# EAGLE design dsbrut2 (EAGLE 6.5.0)
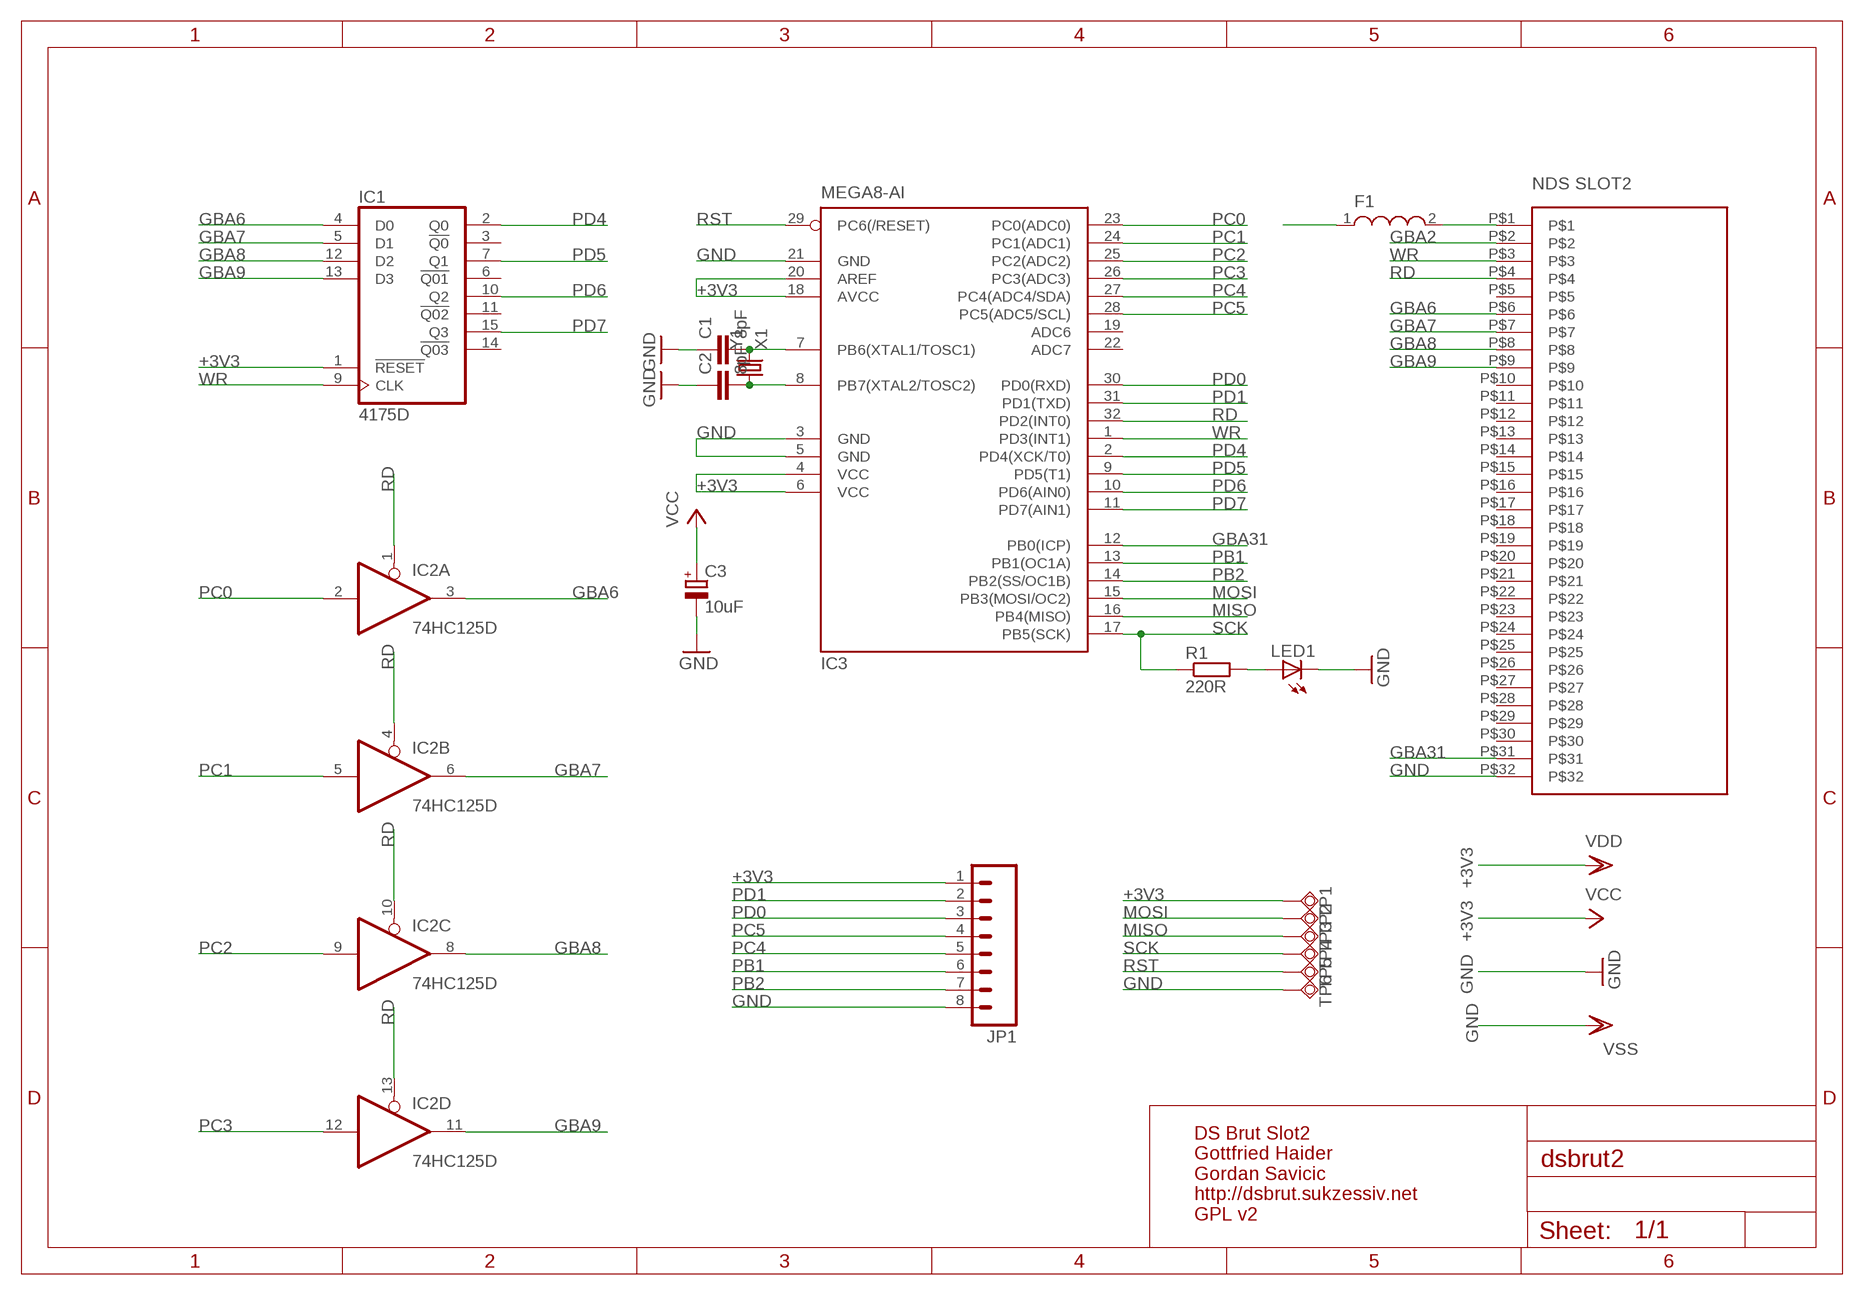
[diagram p0: schematic, sheet 1]

## Parts
C1  8pF  C-EUC0603K  [C0603K]
C2  8pF  C-EUC0603K  [C0603K]
C3  10uF  CPOL-EUSMCA  [SMC_A]
F1  F1  INDUCTOR-L1812  [L1812]
IC1  4175D  [SO16]
IC2  74HC125D  [SO14]
IC3  MEGA8-AI  [TQFP32-08]
JP1  M08LONGPADS  [1X08_LONGPADS]
LED1  LED0603  [LED-0603]
R1  220R  R-EU_M0805  [M0805]
TP1  TPSQTP16R  [TP16R]
TP2  TPSQTP16R  [TP16R]
TP3  TPSQTP16SQ  [TP16SQ]
TP4  TPSQTP16R  [TP16R]
TP5  TPSQTP16R  [TP16R]
TP6  TPSQTP16R  [TP16R]
U$1  DS_CARTRIDGE_SLOT2  [DS-CARTRIDGE-SLOT2]
Y1  X1  CRYSTAL5X3  [CRYSTAL-SMD-5X3]

## Nets
+3V3: C3.+ F1.1 IC1.1(!RESET) IC3.4(VCC) IC3.6(VCC) IC3.18(AVCC) IC3.20(AREF) JP1.1 TP1.TP ; supply symbol labelled VCC, VDD
GBA2: U$1.P$2
GBA6: IC1.4(D0) IC2.3(A:O) U$1.P$6
GBA7: IC1.5(D1) IC2.6(B:O) U$1.P$7
GBA8: IC1.12(D2) IC2.8(C:O) U$1.P$8
GBA9: IC1.13(D3) IC2.11(D:O) U$1.P$9
GBA31: IC3.12(PB0(ICP)) U$1.P$31
GND: C1.1 C2.1 C3.- IC3.3(GND) IC3.5(GND) IC3.21(GND) JP1.8 LED1.C TP6.TP U$1.P$32 ; supply symbol labelled VSS
MISO: IC3.16(PB4(MISO)) TP3.TP
MOSI: IC3.15(PB3(MOSI/OC2)) TP2.TP
N$1: F1.2 U$1.P$1
N$3: C1.2 IC3.7(PB6(XTAL1/TOSC1)) Y1.3
N$4: LED1.A R1.2
PB1: IC3.13(PB1(OC1A)) JP1.6
PB2: IC3.14(PB2(SS/OC1B)) JP1.7
PB7: C2.2 IC3.8(PB7(XTAL2/TOSC2)) Y1.1
PC0: IC2.2(A:I) IC3.23(PC0(ADC0))
PC1: IC2.5(B:I) IC3.24(PC1(ADC1))
PC2: IC2.9(C:I) IC3.25(PC2(ADC2))
PC3: IC2.12(D:I) IC3.26(PC3(ADC3))
PC4: IC3.27(PC4(ADC4/SDA)) JP1.5
PC5: IC3.28(PC5(ADC5/SCL)) JP1.4
PD0: IC3.30(PD0(RXD)) JP1.3
PD1: IC3.31(PD1(TXD)) JP1.2
PD4: IC1.2(Q0) IC3.2(PD4(XCK/T0))
PD5: IC1.7(Q1) IC3.9(PD5(T1))
PD6: IC1.10(Q2) IC3.10(PD6(AIN0))
PD7: IC1.15(Q3) IC3.11(PD7(AIN1))
RD: IC2.1(A:OE) IC2.4(B:OE) IC2.10(C:OE) IC2.13(D:OE) IC3.32(PD2(INT0)) U$1.P$4
RST: IC3.29(PC6(/RESET)) TP5.TP
SCK: IC3.17(PB5(SCK)) R1.1 TP4.TP
WR: IC1.9(CLK) IC3.1(PD3(INT1)) U$1.P$3
Unconnected: IC1.3(!Q0) IC1.6(!Q01) IC1.11(!Q02) IC1.14(!Q03) IC3.19(ADC6) IC3.22(ADC7) U$1.P$5 U$1.P$10 U$1.P$11 U$1.P$12 U$1.P$13 U$1.P$14 U$1.P$15 U$1.P$16 U$1.P$17 U$1.P$18 U$1.P$19 U$1.P$20 U$1.P$21 U$1.P$22 U$1.P$23 U$1.P$24 U$1.P$25 U$1.P$26 U$1.P$27 U$1.P$28 U$1.P$29 U$1.P$30

## Notes on the sheet
- ATMEGA168 | NDS SLOT2
- EXTERNAL PINHEADER
- PROG PADS
- DS Brut Slot2
  Gottfried Haider
  Gordan Savicic
  http://dsbrut.sukzessiv.net
  GPL v2

## Power pins joined to a net without a drawn wire
+3V3: IC1.16(VDD) IC2.14(P:VCC)
GND: IC1.8(VSS) IC2.7(P:GND)

## Library data of the parts
C1 C2 = rcl:C-EU: CAPACITOR, European symbol
C3 = rcl:CPOL-EU: POLARIZED CAPACITOR, European symbol
F1 = dp_devices:INDUCTOR: Inductor
IC1 = 40xx:4175: Quad D FLIP FLOP
IC2 = 74xx-eu:74*125: Quad bus BUFFER, 3-state
IC3 = atmel:MEGA8: MICROCONTROLLER 8 Kbytes FLASH, 1 kbytes SRAM, 512 bytes EEPROM, USART, 6-channel 10 bit ADC, 2-channel 8 bit ADC Pin compatible with Atmega48, ATMega88, ATMega168 Source: avr.lbr; MPN: ATMEGA8-16AU; OC_FARNELL: 9171371; OC_NEWARK: 73M8863
JP1 = SparkFun-Connectors:M08: Header 8 Standard 8-pin 0.1" header. Use with straight break away headers (SKU : PRT-00116), right angle break away headers (PRT-00553), swiss pins (PRT-00743), machine pins (PRT-00117), and female headers (PRT-00115).
LED1 = SparkFunEagle-6-6-07:LED: LEDs Standard schematic elements and footprints for 5mm, 3mm, 1206, and 0603 sized LEDs. 5mm - Spark Fun Electronics SKU : COM-00529 (and others)
R1 = rcl:R-EU_: RESISTOR, European symbol
TP1-TP6 = testpad:TPSQ: Test pad
U$1 = nds_cart:DS_CARTRIDGE_SLOT2
Y1 = SparkFun-FreqCtrl:CRYSTAL: Various standard crystals. Proven footprints. Spark Fun Electronics SKU : COM-00534

## Board
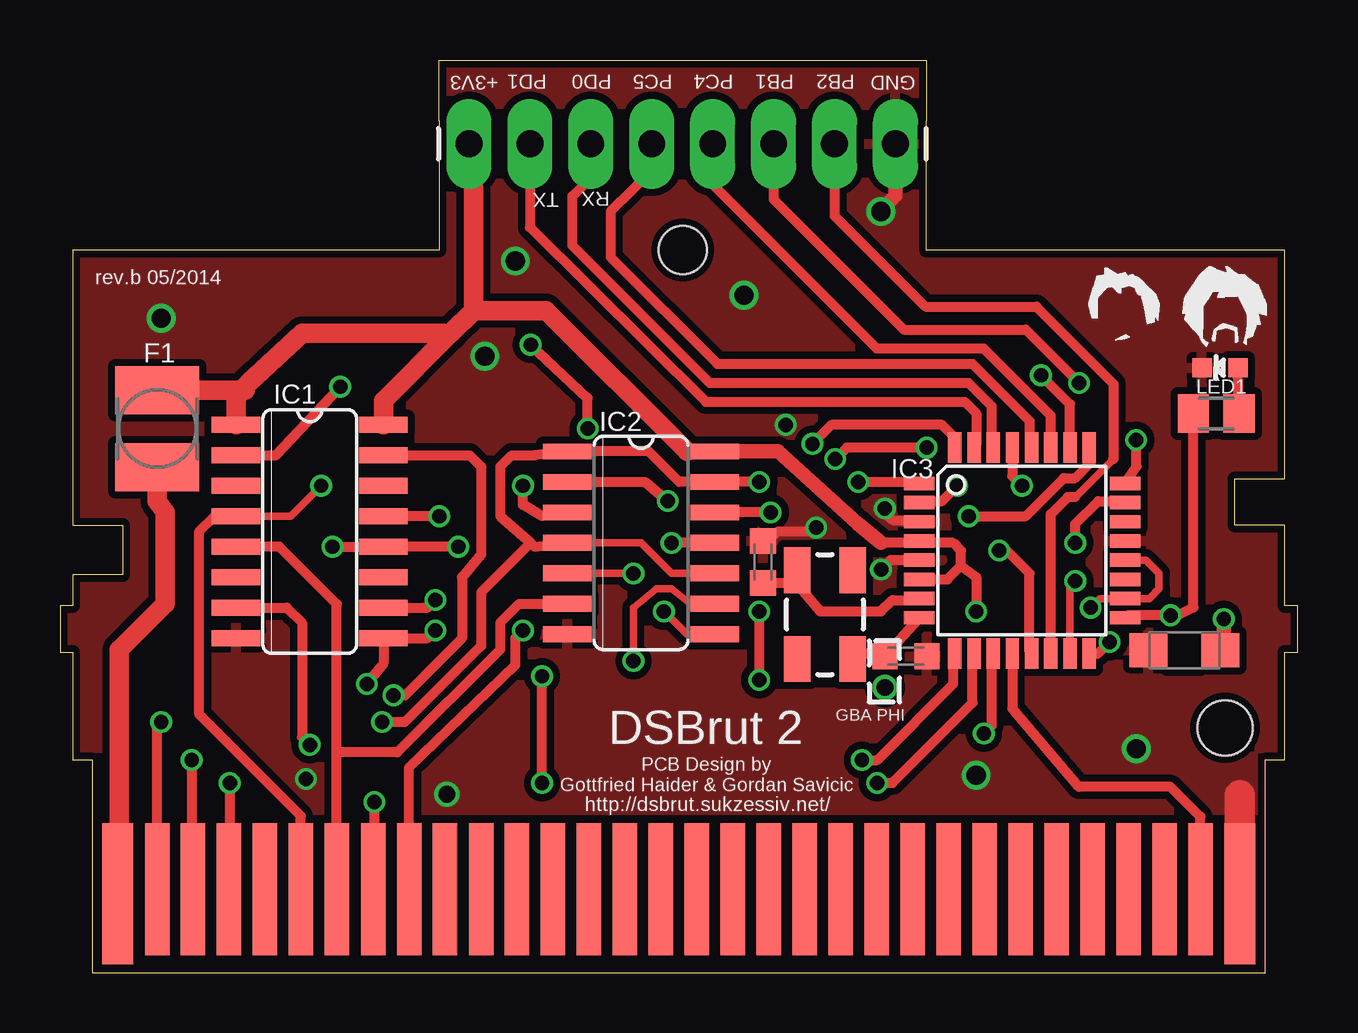
[diagram p1: board, top side]
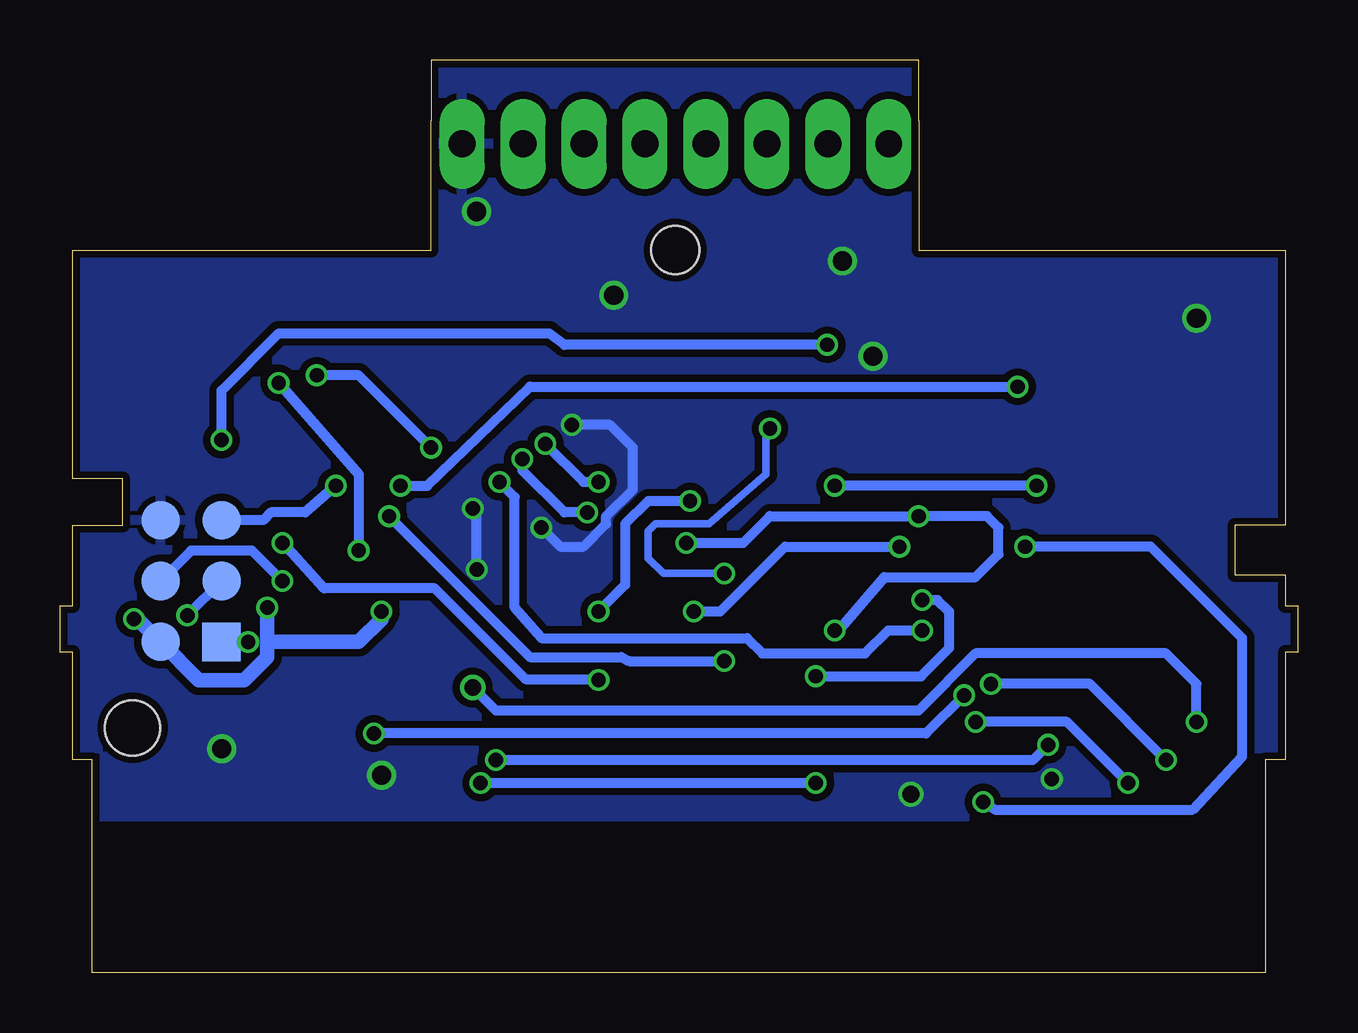
[diagram p2: board, bottom side, seen from below]

Size 51.59 x 38.04 mm. Coordinates in mm from the lower left corner, seen from the top.
Copper layers (1*16): Top 0.035mm / dielectric 1.5mm / Bottom 0.035mm
Design rules "ITEADstudio_DRC *": minimum track width 6mil, minimum drill 12mil, track to track 6mil, track to pad 6mil, pad to pad 6mil, via to via 6mil, smd to smd 0mil, copper to edge 10mil, drill to drill 10mil, minimum pad ring 10mil, minimum via ring 6mil, stop-mask expansion 2mil, vias tented up to drill 25mil, thermal gap 10mil
tRestrict: area 46.1,12.7 to 47.6,14.1; area 31.4,15.9 to 32.5,17.8; area 31.4,12.2 to 32.5,13.9
bRestrict: area 1.4,0 to 50.3,6

### Footprints (pad centres in the part's own frame; a part is rotated, then mirrored left to right if it is on the bottom)
C0603K = smd 1.05 x 1.08: 1 -0.875,0; 2 0.875,0
SMC_A = smd 1.6 x 1.4: + -1.5,0; - 1.5,0
L1812 = smd 2 x 3.5: 1 -1.6,0; 2 1.6,0
SO16 = smd 0.66 x 2.032: 1 -4.445,-3.073; 2 -3.175,-3.073; 3 -1.905,-3.073; 4 -0.635,-3.073; 5 0.635,-3.073; 6 1.905,-3.073; 7 3.175,-3.073; 8 4.445,-3.073; 9 4.445,3.073; 10 3.175,3.073; 11 1.905,3.073; 12 0.635,3.073; 13 -0.635,3.073; 14 -1.905,3.073; 15 -3.175,3.073; 16 -4.445,3.073
SO14 = smd 0.66 x 2.032: 1 -3.81,-3.073; 2 -2.54,-3.073; 3 -1.27,-3.073; 4 0,-3.073; 5 1.27,-3.073; 6 2.54,-3.073; 7 3.81,-3.073; 8 3.81,3.073; 9 2.54,3.073; 10 1.27,3.073; 11 0,3.073; 12 -1.27,3.073; 13 -2.54,3.073; 14 -3.81,3.073
TQFP32-08 = smd 1.27 x 0.559: 1 -4.293,2.8; 2 -4.293,2; 3 -4.293,1.2; 4 -4.293,0.4; 5 -4.293,-0.4; 6 -4.293,-1.2; 7 -4.293,-2; 8 -4.293,-2.8; 17 4.293,-2.8; 18 4.293,-2; 19 4.293,-1.2; 20 4.293,-0.4; 21 4.293,0.4; 22 4.293,1.2; 23 4.293,2; 24 4.293,2.8 | smd 0.559 x 1.27: 9 -2.8,-4.293; 10 -2,-4.293; 11 -1.2,-4.293; 12 -0.4,-4.293; 13 0.4,-4.293; 14 1.2,-4.293; 15 2,-4.293; 16 2.8,-4.293; 25 2.8,4.293; 26 2,4.293; 27 1.2,4.293; 28 0.4,4.293; 29 -0.4,4.293; 30 -1.2,4.293; 31 -2,4.293; 32 -2.8,4.293
1X08_LONGPADS = drill 1.118 pad 1.88 long: 1 0,0; 2 2.54,0; 3 5.08,0; 4 7.62,0; 5 10.16,0; 6 12.7,0; 7 15.24,0; 8 17.78,0
LED-0603 = smd 0.8 x 0.8: A 0,-0.75; C 0,0.75
M0805 = smd 1.3 x 1.6: 1 -0.95,0; 2 0.95,0
TP16R = smd 1.6 x 1.6: TP 0,0
TP16SQ = smd 1.6 x 1.6: TP 0,0
DS-CARTRIDGE-SLOT2 = smd 1.3 x 5.865: P$1 1.041,3.325; P$32 47.816,3.325 | smd 1.02 x 5.5: P$2 2.7,3.5; P$3 4.175,3.5; P$4 5.675,3.5; P$5 7.175,3.5; P$6 8.675,3.5; P$7 10.175,3.5; P$8 11.7,3.5; P$9 13.2,3.5; P$10 14.675,3.5; P$11 16.2,3.5; P$12 17.675,3.5; P$13 19.175,3.5; P$14 20.675,3.5; P$15 22.175,3.5; P$16 23.675,3.5; P$17 25.175,3.5; P$18 26.675,3.5; P$19 28.175,3.5; P$20 29.675,3.5; P$21 31.175,3.5; P$22 32.675,3.5; P$23 34.175,3.5; P$24 35.675,3.5; P$25 37.175,3.5; P$26 38.675,3.5; P$27 40.175,3.5; P$28 41.675,3.5; P$29 43.175,3.5; P$30 44.675,3.5; P$31 46.175,3.5 | hole 2.3: 47.202,10.232 | hole 2: 24.592,30.138
CRYSTAL-SMD-5X3 = smd 1.9 x 1.1: 1 -1.85,-1.15; 2 1.85,-1.15; 3 1.85,1.15; 4 -1.85,1.15

### Placement (x,y rotation side)
C1  29.3,17.12 270 top
C2  35.26,13.19 180 top
C3  46.87,13.44 180 top
F1  4.06,22.68 270 top
IC1  10.41,18.39 270 top
IC2  24.22,17.92 270 top
IC3  40.1,17.6 0 top
JP1  17.05,34.54 0 top
LED1  48.35,25.22 90 top
R1  48.19,23.31 0 top
TP1  47.4,13.79 0 bottom
TP2  47.4,16.33 0 bottom
TP3  44.86,13.79 270 bottom
TP4  44.86,16.33 0 bottom
TP5  44.86,18.87 0 bottom
TP6  47.4,18.87 0 bottom
U$1  1.36,-0.02 0 top
Y1  31.88,14.93 90 top

### Tracks (layer width: path | path; a pad name or v marks a point on that pad's centre or on a via)
+3V3  (via drill 0.6, 0.6 pad 0.81)
  Top 0.305: v42.95,15.22 43.34,15.6 IC3.18 45.4,15.6 45.81,16.01 45.81,16.65 45.26,17.2 IC3.20
  Top 0.406: IC3.6 36.99,16.4 37.56,16.96 | 37.56,16.96 37.56,17.6 37.24,17.92 35.89,17.92 IC3.4 35.72,17.92 34.22,17.92 | 37.56,16.96 38.19,16.49 v38.19,15.06 | 15.97,26.65 16.28,26.65 | 7.39,24.11 7.34,23.95
  Top 0.61: 34.22,17.92 33.27,18.71 29.94,21.73 IC2.14 26.13,21.73 | v48.51,14.74 48.51,13.74 C3.+
  Top 0.813: JP1.1 17.24,32.68 17.24,27.6 | 15.97,26.65 10.09,26.65 7.87,24.58 7.39,24.11 7.72,24.28 F1.1 | 17.24,27.6 16.28,26.65 13.48,23.85 IC1.16 | 17.24,27.6 20.25,27.6 26.13,21.73 | 7.34,23.95 IC1.1
  Bottom 0.61: v38.19,15.06 38.19,14.74 39.14,13.79 42.8,13.79 42.95,13.95 | 42.95,13.95 v42.95,15.22 | TP1.TP 45.81,12.2 43.91,12.2 42.95,13.15 42.95,13.95 | TP1.TP 47.4,13.47 | v48.51,14.74 48.35,14.74 TP1.TP
GBA2  (via drill 0.6, 0.7)
  Top 0.406: U$1.P$2 4.06,10.3 v4.22,10.45
  Bottom 0.406: v4.22,10.45 4.22,12.04 5.49,13.31 13.43,13.31 15.81,10.93 33.42,10.93 v34.39,11.9
GBA6  (via drill 0.6)
  Top 0.305: IC1.4 9.62,19.03 v10.89,20.3
  Top 0.406: U$1.P$6 10.04,6.54 5.81,10.77 5.81,18.39 6.44,19.03 IC1.4 | IC2.3 20.09,19.03 19.3,19.5 v19.3,20.3
  Bottom 0.406: v10.89,20.3 v19.3,20.3
GBA7
  Top 0.406: U$1.P$7 11.54,9.18 | 11.54,9.18 14.06,9.18 18.35,13.47 18.35,14.58 19.14,15.38 IC2.6 | 11.54,9.18 11.54,15.36 9.14,17.76 IC1.5
GBA8  (via drill 0.6)
  Top 0.305: IC2.8 26.13,14.11 v25.17,15.06
  Top 0.406: v16.6,17.76 IC1.12 v11.36,17.76 | U$1.P$8 13.11,3.52 v13.11,7.12
  Bottom 0.406: v25.17,15.06 24.06,15.06 21.36,17.76 v16.6,17.76 | v13.11,7.12 12.63,6.8 4.38,6.8 2.31,9.03 2.31,13.95 6.12,17.76 v11.36,17.76
GBA9  (via drill 0.6)
  Top 0.406: IC2.11 v25.49,17.92 | v15.81,19.03 IC1.13 | U$1.P$9 14.56,8.57 18.98,12.84 18.98,13.95 v19.3,14.26
  Bottom 0.406: v25.49,17.92 23.11,17.92 22,19.03 v15.81,19.03 12.95,19.03 12.47,18.55 12.47,17.44 13.43,16.49 17.24,16.49 19.14,14.26 v19.3,14.26
GBA31
  Top 0.406: U$1.P$31 47.54,6.51 46.29,7.76 42.48,7.76 39.78,10.93 39.7,11.01 IC3.12
GND  (via drill 0.6, 0.7 pad 0.81, 0.8, 0.8 pad 0.81)
  Top 0.406: C1.1 29.54,18 29.94,18.39 31.21,18.39 | IC3.5 34.62,17.2 v34.22,16.81 | v34.38,19.34 34.38,19.19 34.7,18.87 35.73,18.87 IC3.3 | 49.18,7.41 49.15,7.44
  Top 0.61: v34.22,31.73 34.81,32.4 JP1.8
  Top 1.27: U$1.P$32 49.18,7.41
  Bottom 0.406: v34.22,16.81 34.22,19.19 v34.38,19.34 | v31.52,18.55 30.73,17.76 29.78,17.76 28.83,18.71 28.83,19.03 27.71,20.14 27.71,21.88 28.67,22.84 v30.25,22.84 | TP6.TP 47.24,18.87
  other vias: 17.71,25.69 4.22,27.28 28.51,28.23 10.25,8.07 44.86,9.34 18.98,29.66 16.12,7.44 38.19,8.23
  pour Top (isolate 0.305, rank 6): -0.7,6.8 52.64,6.8 52.8,39.98 -0.54,39.98
  pour Bottom (isolate 0.305): -0.86,6.33 52.48,6.33 52.8,39.98 -0.54,39.98
MISO  (via drill 0.6)
  Top 0.406: IC3.16 43.27,13.31 v43.75,13.79
  Bottom 0.406: v43.75,13.79 TP3.TP
MOSI  (via drill 0.6)
  Top 0.305: IC3.15 42.1,16.11 v42.32,16.33
  Bottom 0.406: v42.32,16.33 43.59,17.6 46.13,17.6 TP2.TP
N$1
  Top 0.813: F1.2 4.06,19.66 4.38,19.19 4.38,15.38 2.47,13.47 2.47,3.37 U$1.P$1
N$3
  Top 0.406: Y1.3 30.6,16.75 | Y1.3 30.69,16.21 31.68,15.06 34.22,15.06 34.7,15.53 35.74,15.53 IC3.7 | C1.2 30.73,16.25 Y1.3
N$4
  Top 0.406: R1.2 LED1.A
PB1  (via drill 0.6)
  Top 0.406: JP1.6 29.75,32.23 35.18,26.81 40.26,26.81 v42.48,24.58 | IC3.13 40.41,13.39 40.41,16.65 39.46,17.6 v39.14,17.6
  Bottom 0.406: v42.48,24.58 39.14,20.77 v39.14,17.6
PB2
  Top 0.305: 43.91,21.41 42.32,19.82
  Top 0.406: IC3.14 41.3,19.12 42,19.82 42.32,19.82 | JP1.7 32.29,31.54 36.07,27.76 40.7,27.76 43.92,24.55 43.92,21.42 43.91,21.41
PB7
  Top 0.406: 35.73,14.74 35.75,14.74 | 35.75,14.74 IC3.8 | Y1.1 33.03,13.38 C2.2 35.78,14.74 35.75,14.74
PC0  (via drill 0.6)
  Top 0.406: IC2.2 24.38,20.46 v25.33,19.66 | v42.32,17.92 42.32,18.71 43.27,19.66 44.33,19.66 IC3.23 | v29.14,15.06 v29.14,12.2
  Bottom 0.406: v42.32,17.92 40.57,16.01 40.57,16.02 35.97,16.02 32.2,12.24 29.19,12.24 v29.14,12.2 | v25.33,19.66 27.08,19.66 28.03,18.71 28.03,16.17 v29.14,15.06
PC1  (via drill 0.6)
  Top 0.305: IC2.5 v23.9,16.65
  Top 0.406: IC3.24 44.87,21.1 v44.86,22.2 | v22,22.68 22,23.95 v19.62,26.17
  Bottom 0.305: v22,22.68 22.16,22.84 22.16,20.77 24.54,18.71 26.76,18.71 27.08,18.39 27.08,17.28 26.44,16.65 v23.9,16.65
  Bottom 0.406: v44.86,22.2 44.86,24.27 42.48,26.65 31.21,26.65 30.57,26.17 v19.62,26.17
PC2  (via drill 0.6)
  Top 0.305: v23.9,13 23.9,15.22 24.86,16.01 25.49,16.01 26.29,15.38
  Top 0.406: v37.87,19.03 40.26,19.03 41.84,20.61 42.32,20.61 42.95,21.25 42.95,21.83 IC3.25 | 26.29,15.38 IC2.9
  Bottom 0.406: v23.9,13 27.87,13 28.19,13.15 32,13.15 v37.87,19.03
PC3  (via drill 0.6)
  Top 0.406: IC3.26 42.1,23.7 v40.89,24.9 | 28.09,19.19 IC2.12 v29.62,19.19 | v36.13,21.88 32.79,21.88 v32.32,21.41
  Bottom 0.406: v36.13,21.88 39.14,24.9 v40.89,24.9 | v29.62,19.19 30.57,19.19 32.32,20.93 v32.32,21.41
PC4
  Top 0.406: IC3.27 41.3,23.22 38.51,26.01 34.05,26.01 27.21,32.86 JP1.5
PC5
  Top 0.406: JP1.4 24.67,33.42 22.95,31.73 22.95,29.82 27.4,25.38 38.03,25.38 40.41,23 40.41,21.97 IC3.28
PD0
  Top 0.406: IC3.30 38.83,21.96 38.83,23.63 37.87,24.58 27.08,24.58 21.36,30.3 21.36,32.36 22.13,33.13 JP1.3
PD1
  Top 0.406: JP1.2 19.59,31.07 26.92,23.79 37.72,23.79 38.19,23.31 38.19,21.99 IC3.31
PD4  (via drill 0.6)
  Top 0.406: IC3.2 35.87,19.66 36.76,19.66 v37.4,20.3 | IC1.2 8.98,21.57 v11.68,24.43
  Bottom 0.406: v37.4,20.3 36.29,20.3 32,24.43 v11.68,24.43
PD5  (via drill 0.6)
  Top 0.406: IC3.9 37.24,13.25 37.24,12.04 34.06,8.87 v33.43,8.87 | IC1.7 9.46,15.22 10.09,14.58 10.09,9.82 v10.41,9.5
  Bottom 0.406: v10.41,9.5 11.05,8.87 v33.43,8.87
PD6  (via drill 0.6)
  Top 0.406: v20.09,7.92 v20.09,12.36 | IC1.10 15.33,15.22 v15.65,15.53 | v34.06,7.92 34.7,7.92 38.03,11.25 38.03,13.24 IC3.10
  Bottom 0.406: v20.09,12.36 15.71,12.36 14.54,13.53 14.54,15.06 15.01,15.53 v15.65,15.53 | v34.06,7.92 v20.09,7.92
PD7  (via drill 0.6)
  Top 0.406: IC1.15 17.08,21.57 17.55,21.09 17.55,17.44 16.76,16.49 16.76,13.95 14.38,11.57 v13.9,11.57 | IC3.11 38.83,13.24 38.83,10.3 v38.51,9.98
  Bottom 0.406: v13.9,11.57 15.49,9.98 v38.51,9.98
RD  (via drill 0.6)
  Top 0.305: IC2.4 24.22,17.92 25.49,16.65 IC2.10
  Top 0.406: 19.62,17.92 18.35,19.03 18.35,21.09 18.82,21.57 19.78,21.57 IC2.1 24.54,21.73 25.81,20.46 IC2.13 v29.14,20.46 | 19.62,17.92 19.78,17.76 IC2.4 | v7.08,7.92 7.08,3.52 U$1.P$4 | v13.43,10.45 14.38,10.45 17.55,13.63 17.55,15.85 19.62,17.92 | IC3.32 37.3,22.3 36.76,22.84 32.16,22.84 v31.37,22.04
  Bottom 0.406: v7.08,7.92 9.62,10.45 v13.43,10.45 | v31.37,22.04 29.78,20.46 v29.14,20.46
RST  (via drill 0.6)
  Top 0.406: IC3.29 39.7,20.7 v40.1,20.3
  Bottom 0.406: v40.1,20.3 41.37,19.19 42.8,19.19 43.11,18.87 TP5.TP
SCK  (via drill 0.6)
  Top 0.406: 44.45,14.74 IC3.17 44.49,14.9 v46.29,14.9 46.61,14.9 47.24,15.22 R1.1
  Bottom 0.406: TP4.TP v46.29,14.9
WR  (via drill 0.6)
  Top 0.406: v12.79,12.04 13.48,12.89 IC1.9 15.33,13.95 v15.65,14.26 | v5.49,8.87 5.49,3.52 U$1.P$3 | v33.27,20.46 35.75,20.46 IC3.1
  Bottom 0.406: v33.27,20.46 32.64,19.82 32.64,15.22 31.52,13.95 22.95,13.95 22.32,13.31 18.03,13.31 17.08,14.26 v15.65,14.26 | v5.49,8.87 8.66,12.04 v12.79,12.04

### Text on the board
tNames: +3V3 | PD1 | PD0 | PC5 | PC4 | PB1 | PB2 | GND | TX | RX | rev.b 05/2014 | GBA PHI | DSBrut 2 | PCB Design by / Gottfried Haider & Gordan Savicic | http://dsbrut.sukzessiv.net/